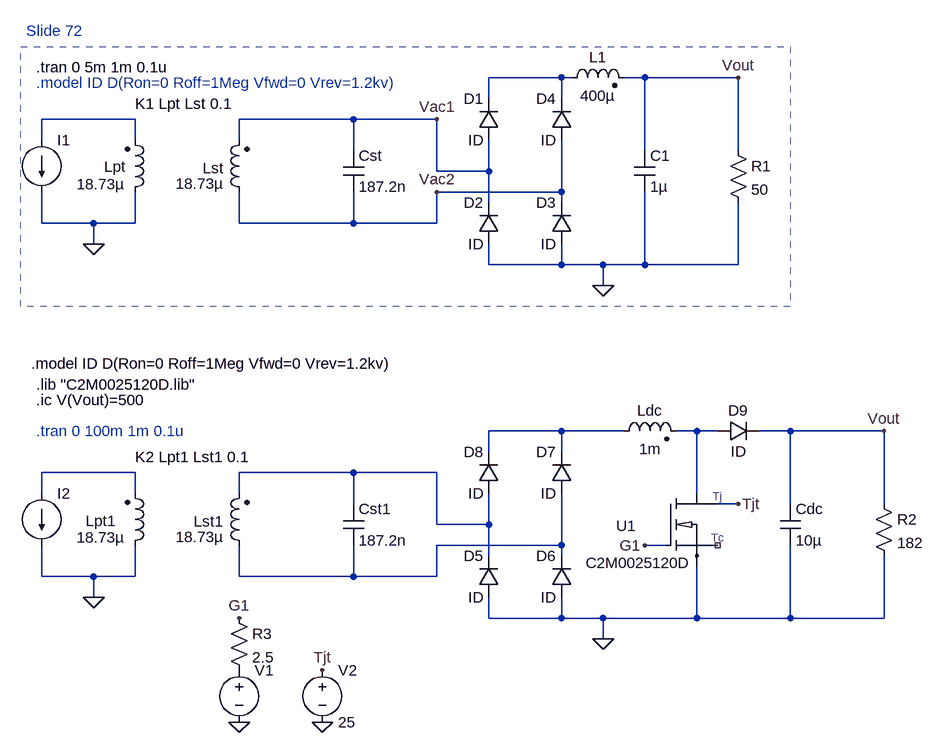
[diagram p0: schematic Slide72_LTSpice.asc]
Slide72_LTSpice.asc, the LTspice schematic file:
Version 4
SHEET 1 1824 1028
WIRE 544 16 432 16
WIRE 560 16 544 16
WIRE 672 16 640 16
WIRE 816 16 672 16
WIRE 432 48 432 16
WIRE 544 48 544 16
WIRE -112 80 -256 80
WIRE 224 80 48 80
WIRE 352 80 224 80
WIRE -256 112 -256 80
WIRE -112 112 -112 80
WIRE 48 112 48 80
WIRE 224 128 224 80
WIRE 672 128 672 16
WIRE 816 128 816 16
WIRE 352 160 352 80
WIRE 432 160 432 112
WIRE 432 160 352 160
WIRE 544 192 544 112
WIRE 544 192 352 192
WIRE 432 208 432 160
WIRE 544 208 544 192
WIRE -256 240 -256 192
WIRE -176 240 -256 240
WIRE -112 240 -112 192
WIRE -112 240 -176 240
WIRE 48 240 48 192
WIRE 224 240 224 192
WIRE 224 240 48 240
WIRE 352 240 352 192
WIRE 352 240 224 240
WIRE -176 272 -176 240
WIRE 432 304 432 272
WIRE 544 304 544 272
WIRE 544 304 432 304
WIRE 608 304 544 304
WIRE 672 304 672 192
WIRE 672 304 608 304
WIRE 816 304 816 208
WIRE 816 304 672 304
WIRE 608 336 608 304
WIRE 544 560 432 560
WIRE 640 560 544 560
WIRE 752 560 720 560
WIRE 784 560 752 560
WIRE 896 560 848 560
WIRE 1040 560 896 560
WIRE 432 592 432 560
WIRE 544 592 544 560
WIRE -112 624 -256 624
WIRE 224 624 48 624
WIRE 352 624 224 624
WIRE -256 656 -256 624
WIRE -112 656 -112 624
WIRE 48 656 48 624
WIRE 752 656 752 560
WIRE 224 672 224 624
WIRE 816 672 784 672
WIRE 896 672 896 560
WIRE 1040 672 1040 560
WIRE 352 704 352 624
WIRE 432 704 432 656
WIRE 432 704 352 704
WIRE 544 736 544 656
WIRE 544 736 352 736
WIRE 704 736 672 736
WIRE 432 752 432 704
WIRE 544 752 544 736
WIRE -256 784 -256 736
WIRE -176 784 -256 784
WIRE -112 784 -112 736
WIRE -112 784 -176 784
WIRE 48 784 48 736
WIRE 224 784 224 736
WIRE 224 784 48 784
WIRE 352 784 352 736
WIRE 352 784 224 784
WIRE -176 816 -176 784
WIRE 432 848 432 816
WIRE 544 848 544 816
WIRE 544 848 432 848
WIRE 608 848 544 848
WIRE 752 848 752 768
WIRE 752 848 608 848
WIRE 896 848 896 736
WIRE 896 848 752 848
WIRE 1040 848 1040 752
WIRE 1040 848 896 848
WIRE 608 880 608 848
FLAG -176 272 0
FLAG 608 336 0
FLAG 352 80 Vac1
FLAG 352 192 Vac2
FLAG 816 16 Vout
FLAG -176 816 0
FLAG 608 880 0
FLAG 1040 560 Vout
FLAG 176 1008 0
FLAG 48 1008 0
FLAG 48 848 G1
FLAG 672 736 G1
FLAG 816 672 Tjt
FLAG 176 928 Tjt
SYMBOL cap 208 128 R0
SYMATTR InstName Cst
SYMATTR Value 187.2n
SYMBOL current -256 112 R0
WINDOW 3 3 80 Invisible 2
WINDOW 123 0 0 Left 0
WINDOW 39 0 0 Left 0
SYMATTR Value SINE(0 14.14 85k)
SYMATTR InstName I1
SYMBOL ind2 64 208 R180
WINDOW 0 40 53 Left 2
WINDOW 3 39 29 Left 2
SYMATTR InstName Lst
SYMATTR Value 18.73µ
SYMBOL ind2 -128 208 M180
WINDOW 0 -32 55 Left 2
WINDOW 3 -74 28 Left 2
SYMATTR InstName Lpt
SYMATTR Value 18.73µ
SYMBOL diode 448 272 R180
WINDOW 0 24 64 Left 2
WINDOW 3 24 0 Left 2
SYMATTR InstName D2
SYMATTR Value ID
SYMBOL diode 560 272 R180
WINDOW 0 24 64 Left 2
WINDOW 3 24 0 Left 2
SYMATTR InstName D3
SYMATTR Value ID
SYMBOL diode 560 112 R180
WINDOW 0 24 64 Left 2
WINDOW 3 24 0 Left 2
SYMATTR InstName D4
SYMATTR Value ID
SYMBOL diode 448 112 R180
WINDOW 0 24 64 Left 2
WINDOW 3 24 0 Left 2
SYMATTR InstName D1
SYMATTR Value ID
SYMBOL cap 656 128 R0
SYMATTR InstName C1
SYMATTR Value 1µ
SYMBOL res 800 112 R0
SYMATTR InstName R1
SYMATTR Value 50
SYMBOL ind2 544 32 R270
WINDOW 0 32 56 VTop 2
WINDOW 3 4 56 VBottom 2
SYMATTR InstName L1
SYMATTR Value 400µ
SYMBOL cap 208 672 R0
SYMATTR InstName Cst1
SYMATTR Value 187.2n
SYMBOL ind2 64 752 R180
WINDOW 0 40 53 Left 2
WINDOW 3 39 29 Left 2
SYMATTR InstName Lst1
SYMATTR Value 18.73µ
SYMBOL ind2 -128 752 M180
WINDOW 0 -60 54 Left 2
WINDOW 3 -74 28 Left 2
SYMATTR InstName Lpt1
SYMATTR Value 18.73µ
SYMBOL diode 448 816 R180
WINDOW 0 24 64 Left 2
WINDOW 3 24 0 Left 2
SYMATTR InstName D5
SYMATTR Value ID
SYMBOL diode 560 816 R180
WINDOW 0 24 64 Left 2
WINDOW 3 24 0 Left 2
SYMATTR InstName D6
SYMATTR Value ID
SYMBOL diode 560 656 R180
WINDOW 0 24 64 Left 2
WINDOW 3 24 0 Left 2
SYMATTR InstName D7
SYMATTR Value ID
SYMBOL diode 448 656 R180
WINDOW 0 24 64 Left 2
WINDOW 3 24 0 Left 2
SYMATTR InstName D8
SYMATTR Value ID
SYMBOL cap 880 672 R0
SYMATTR InstName Cdc
SYMATTR Value 10µ
SYMBOL res 1024 656 R0
SYMATTR InstName R2
SYMATTR Value 182
SYMBOL ind2 624 576 R270
WINDOW 0 32 56 VTop 2
WINDOW 3 4 56 VBottom 2
SYMATTR InstName Ldc
SYMATTR Value 1m
SYMBOL current -256 656 R0
WINDOW 3 3 80 Invisible 2
WINDOW 123 0 0 Left 0
WINDOW 39 0 0 Left 0
SYMATTR Value SINE(0 70.71 85k)
SYMATTR InstName I2
SYMBOL diode 784 576 R270
WINDOW 0 32 32 VTop 2
WINDOW 3 0 32 VBottom 2
SYMATTR InstName D9
SYMATTR Value ID
SYMBOL voltage 48 912 R0
WINDOW 3 24 96 Invisible 2
WINDOW 123 0 0 Left 0
WINDOW 39 0 0 Left 0
SYMATTR Value PULSE(0 12 0 0 0 5u 10u)
SYMATTR InstName V1
SYMBOL voltage 176 912 R0
WINDOW 123 0 0 Left 0
WINDOW 39 0 0 Left 0
SYMATTR InstName V2
SYMATTR Value 25
SYMBOL res 32 832 R0
SYMATTR InstName R3
SYMATTR Value 2.5
SYMBOL WolfspeedMOSFET\\nmos_TO247_3L 704 656 R0
WINDOW 3 -123 107 Left 2
SYMATTR Value C2M0025120D
SYMATTR InstName U1
TEXT -112 56 Left 2 !K1 Lpt Lst 0.1
TEXT -264 0 Left 2 !.tran 0 5m 1m 0.1u
TEXT -264 24 Left 2 ;.model ID D(Ron=0 Roff=1Meg Vfwd=0 Vrev=1.2kv)
TEXT -280 -56 Left 2 ;Slide 72
TEXT -112 600 Left 2 !K2 Lpt1 Lst1 0.1
TEXT -264 560 Left 2 ;.tran 0 100m 1m 0.1u
TEXT -272 456 Left 2 !.model ID D(Ron=0 Roff=1Meg Vfwd=0 Vrev=1.2kv)
TEXT -264 512 Left 2 !.ic V(Vout)=500
TEXT -264 488 Left 2 !.lib "C2M0025120D.lib"
RECTANGLE Normal 896 368 -288 -32 2

The netlist it stands for:
* Slide72_LTSpice.asc
Cst Vac1 Vac2 187.2n
I1 N002 0 SINE(0 14.14 85k)
Lst Vac2 Vac1 18.73µ
Lpt 0 N002 18.73µ
D2 0 Vac1 ID
D3 0 Vac2 ID
D4 Vac2 N001 ID
D1 Vac1 N001 ID
C1 Vout 0 1µ
R1 Vout 0 50
L1 N001 Vout 400µ
Cst1 N006 N007 187.2n
Lst1 N007 N006 18.73µ
Lpt1 0 N005 18.73µ
D5 0 N006 ID
D6 0 N007 ID
D7 N007 N003 ID
D8 N006 N003 ID
Cdc Vout 0 10µ
R2 Vout 0 182
Ldc N003 N004 1m
I2 N005 0 SINE(0 70.71 85k)
D9 N004 Vout ID
V1 P001 0 PULSE(0 12 0 0 0 5u 10u)
V2 Tjt 0 25
R3 G1 P001 2.5
XU1 N004 G1 0 Tjt NC_01 C2M0025120D  ; pins D G S Tj Tc
.model D D
.lib standard.dio
K1 Lpt Lst 0.1
.tran 0 5m 1m 0.1u
* .model ID D(Ron=0 Roff=1Meg Vfwd=0 Vrev=1.2kv)
* Slide 72
K2 Lpt1 Lst1 0.1
* .tran 0 100m 1m 0.1u
.model ID D(Ron=0 Roff=1Meg Vfwd=0 Vrev=1.2kv)
.ic V(Vout)=500
.lib "C2M0025120D.lib"
.backanno
.end